# EAGLE design Board_v2 (EAGLE 9.2.2)
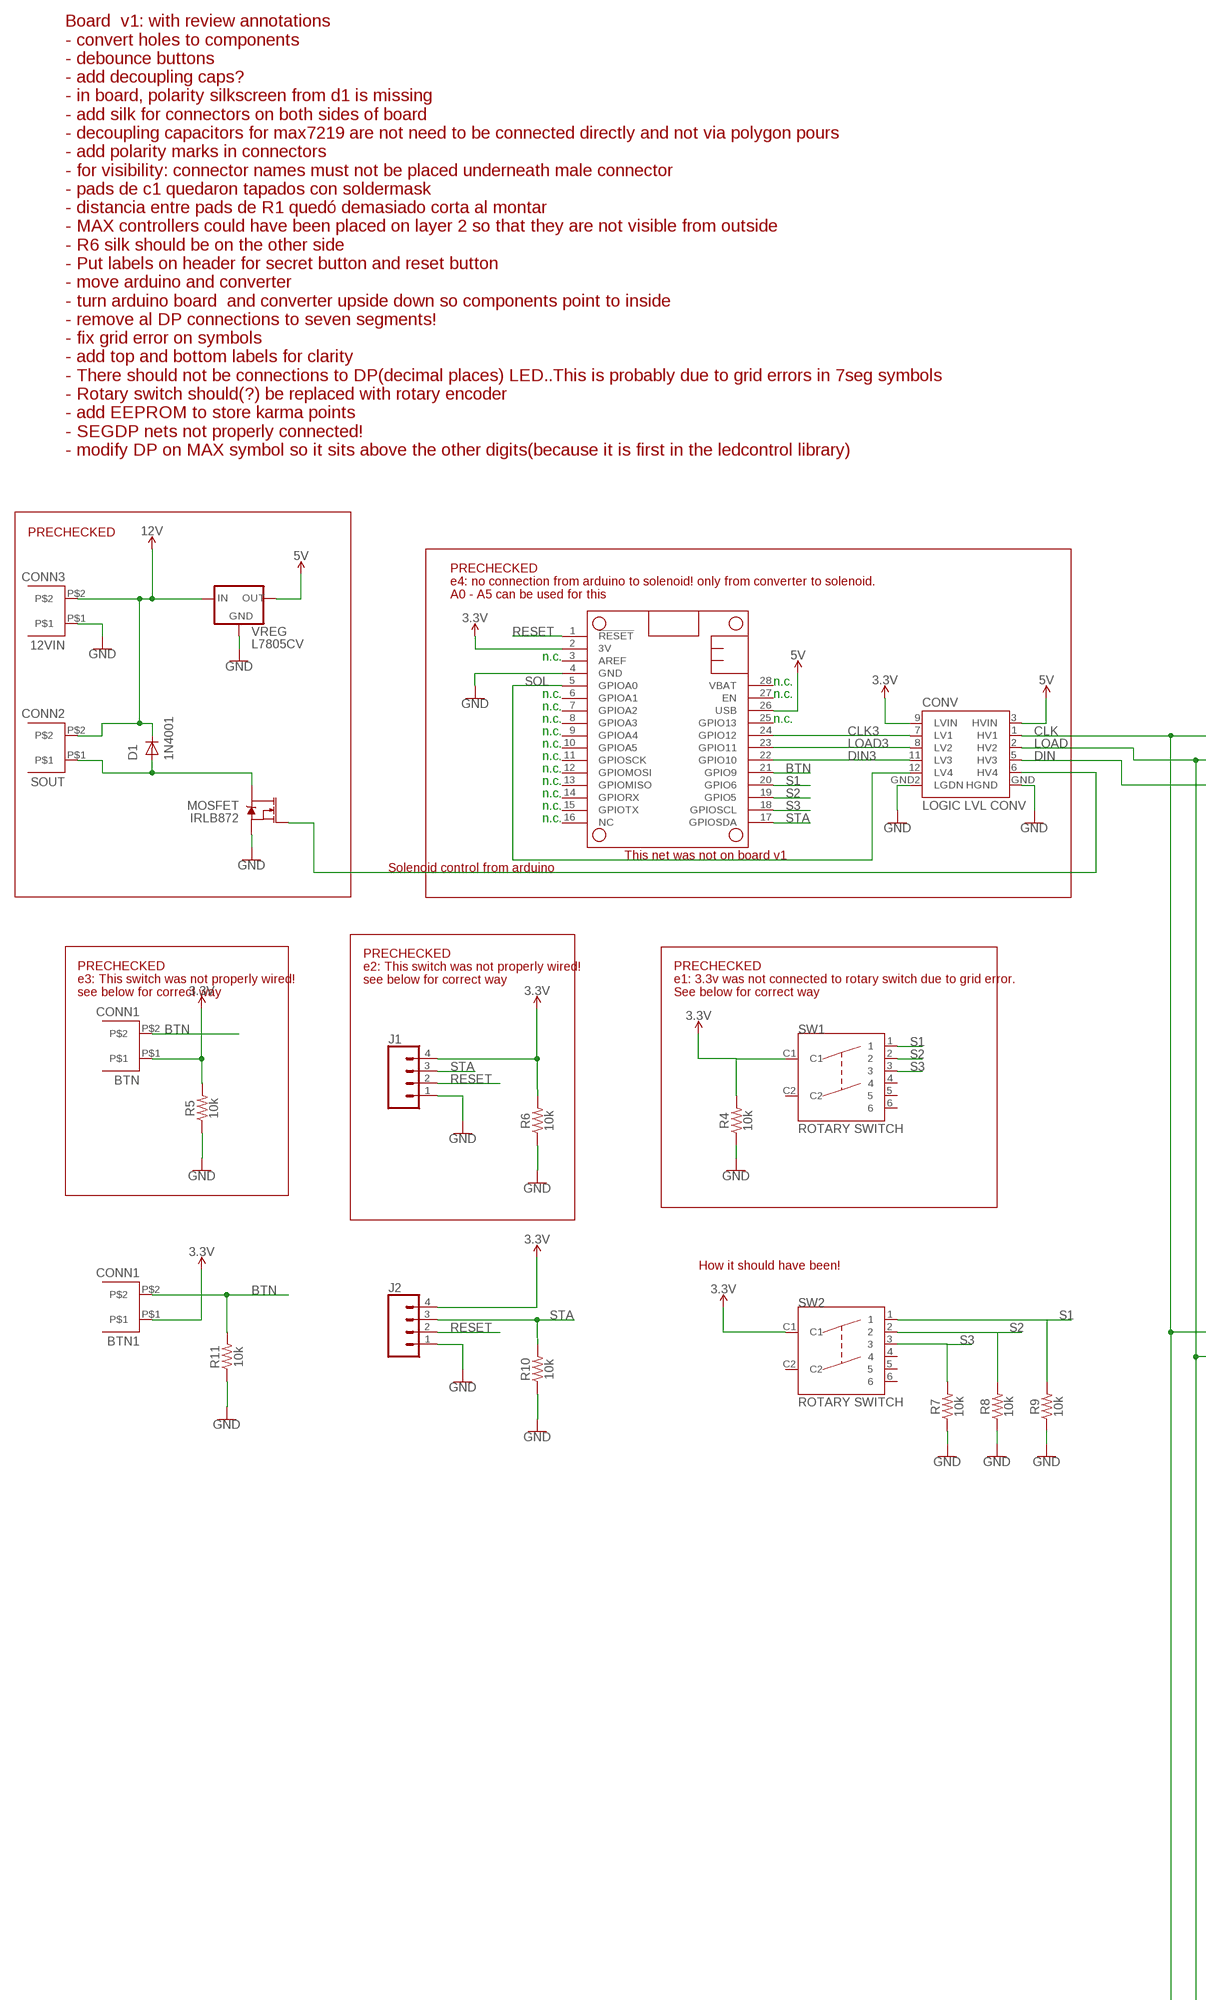
[diagram p0: schematic, sheet 1, part 1 of 3]
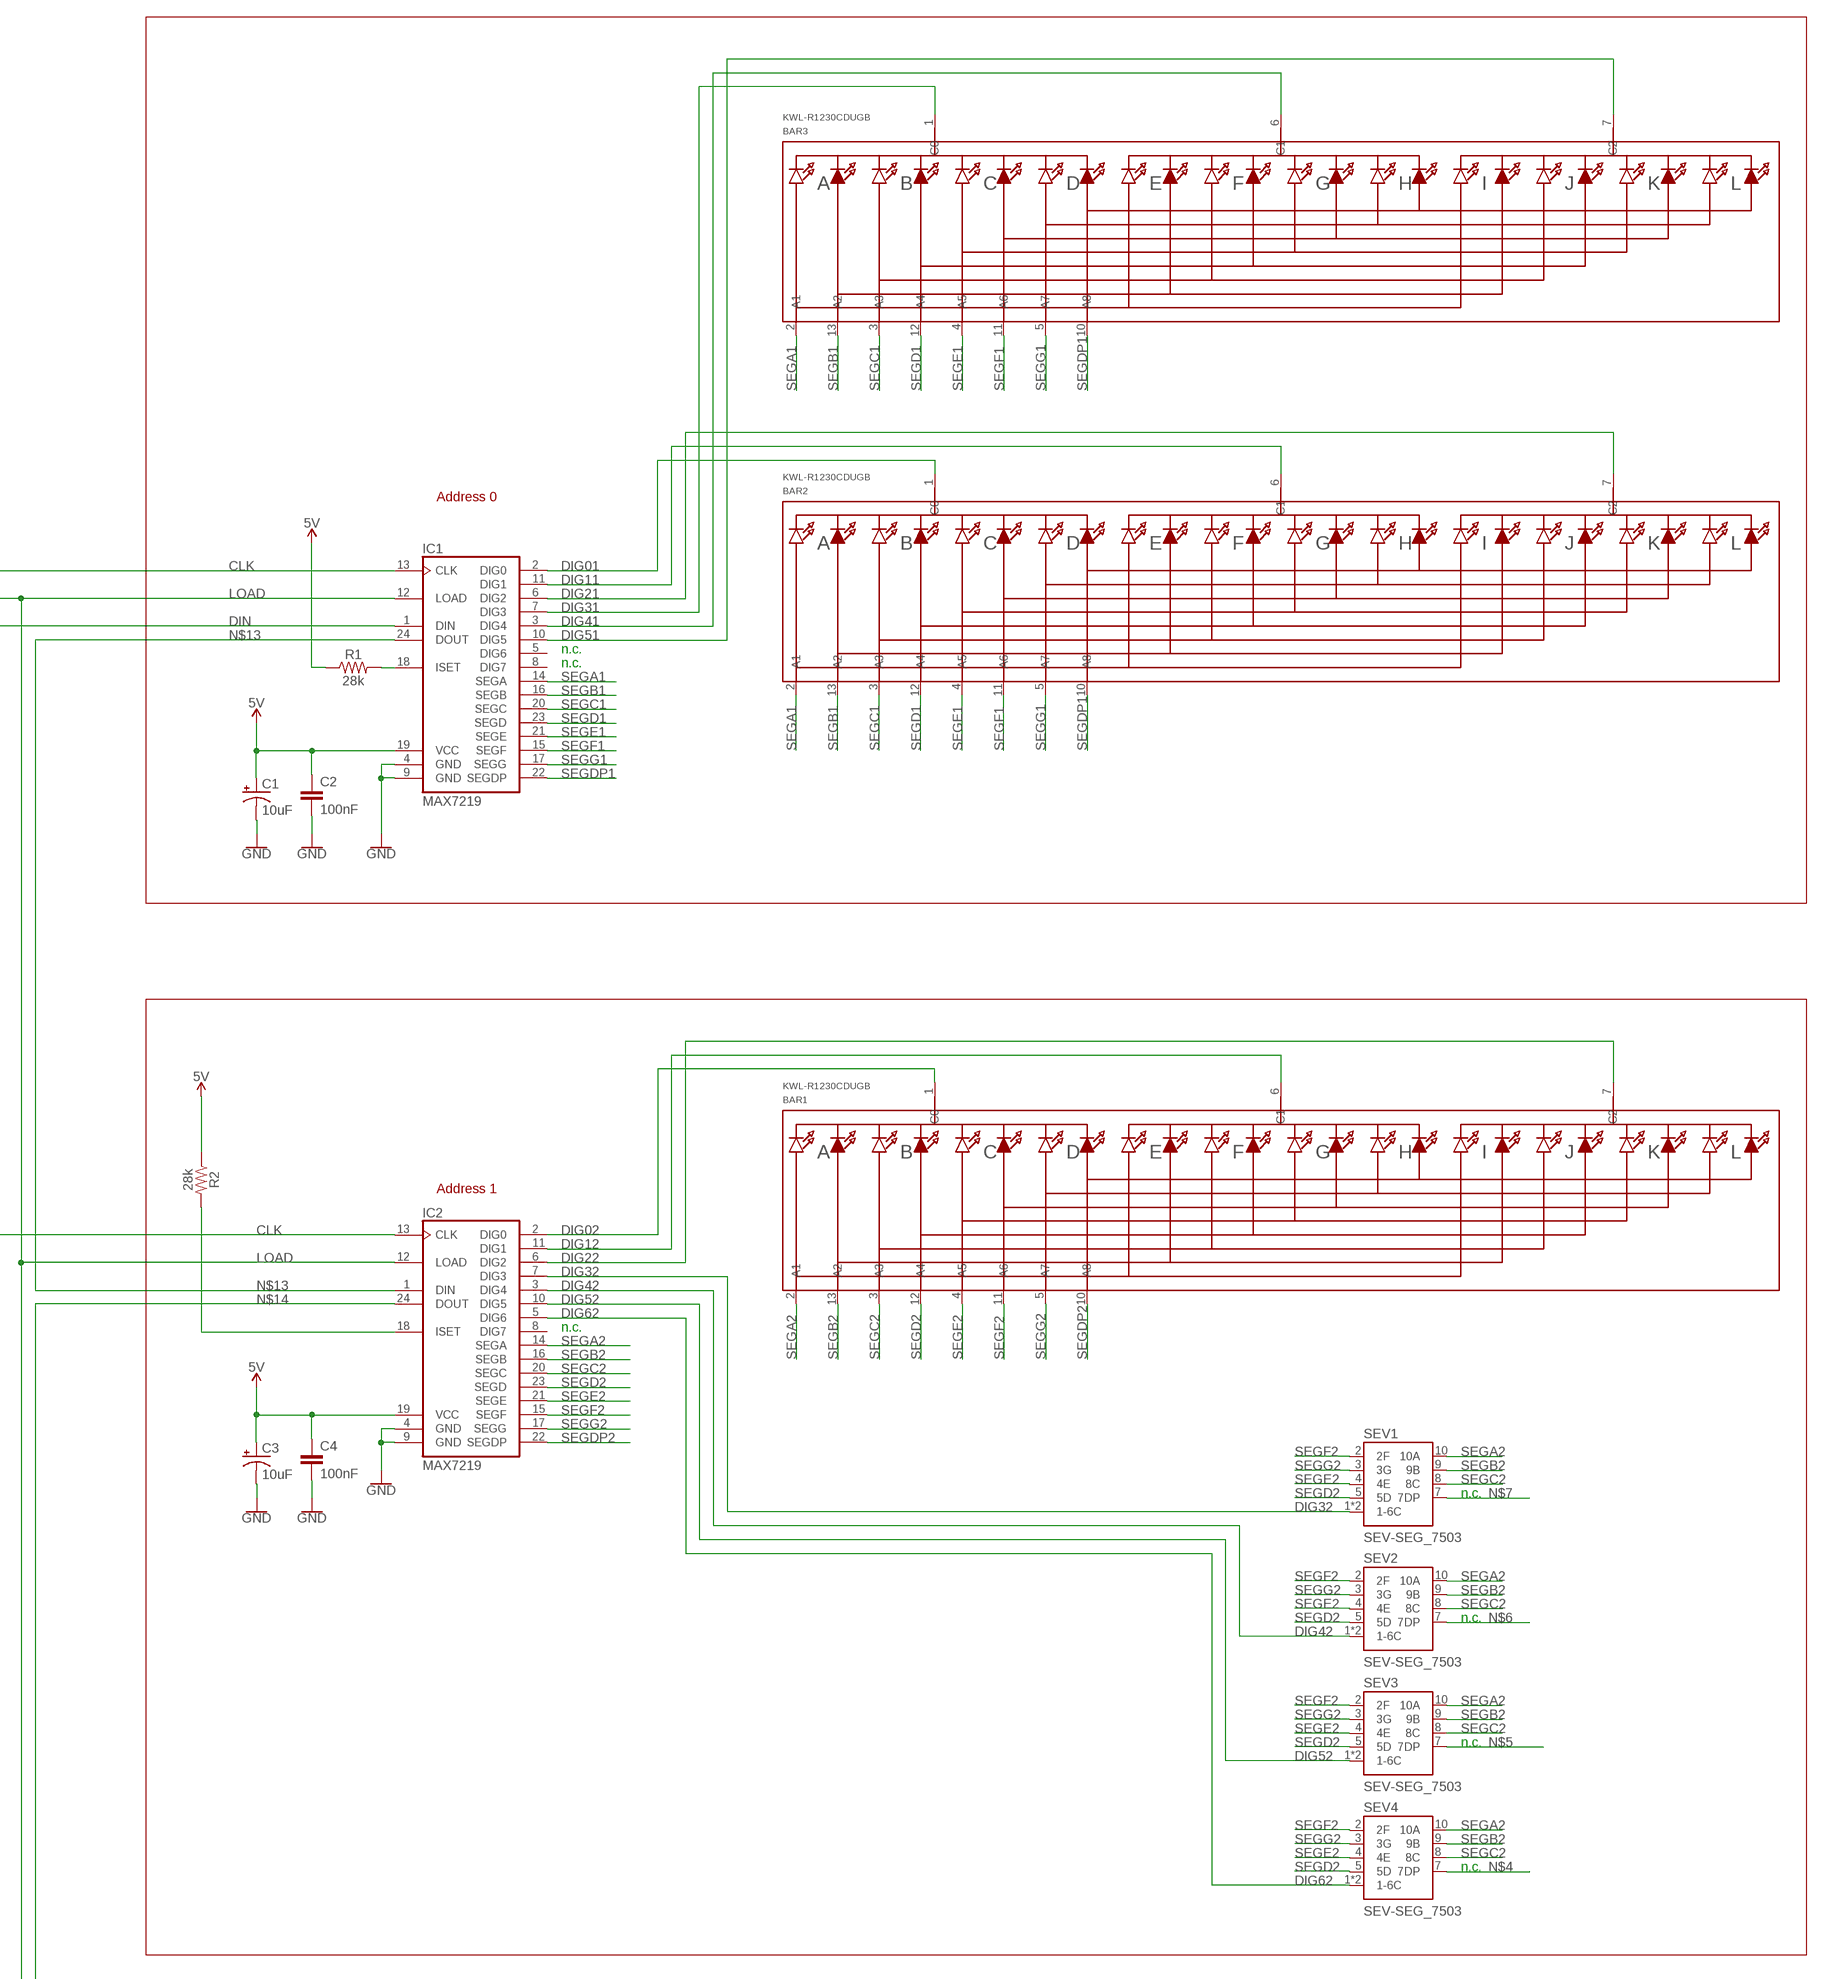
[diagram p1: schematic, sheet 1, part 2 of 3]
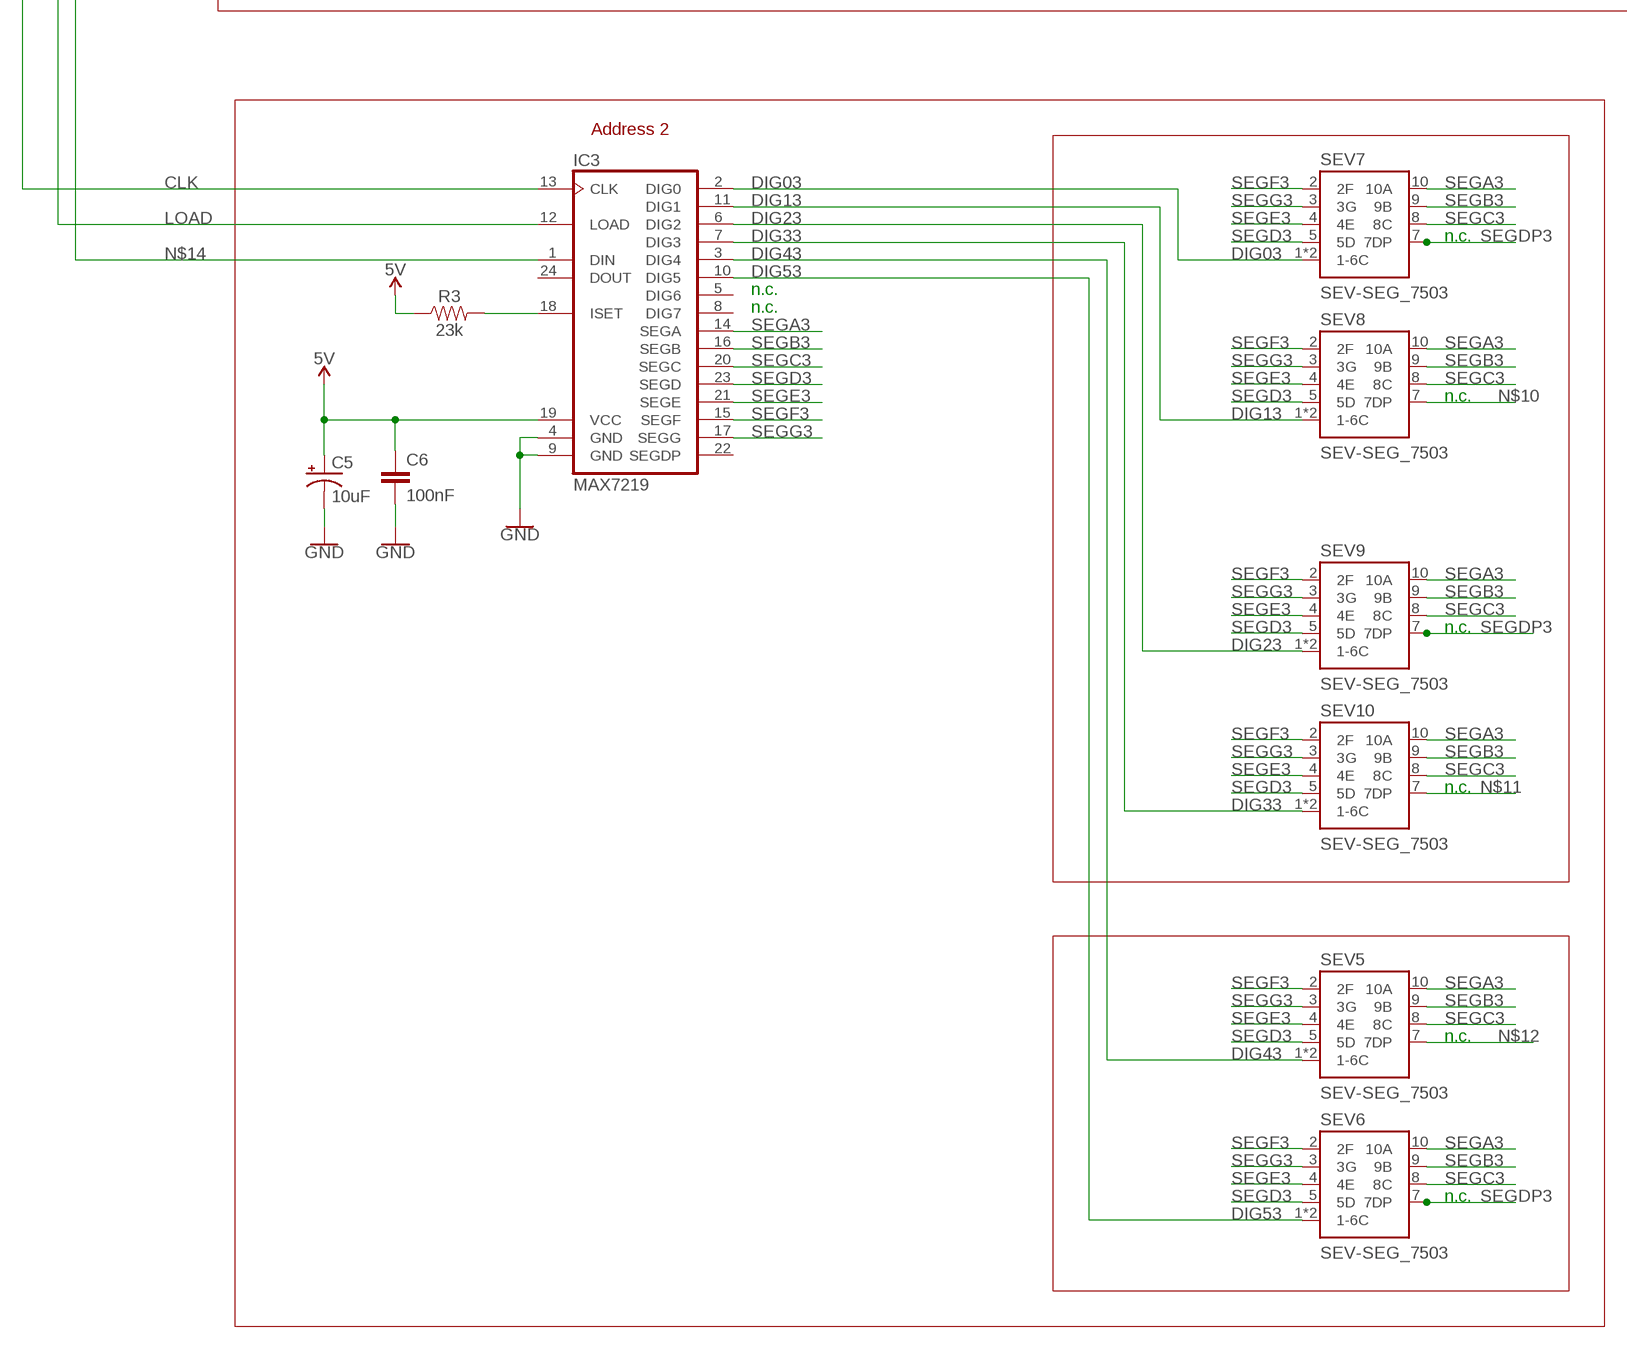
[diagram p2: schematic, sheet 1, part 3 of 3]

## Parts
12VIN  CONN3  MICRO-FIT_3.0_43650  [MICRO-FIT_43560_3MM]
BAR1  KWL-R1230CDUGB  [SEGMENT_BICOL_BL-AR12Z3010]
BAR2  KWL-R1230CDUGB  [SEGMENT_BICOL_BL-AR12Z3010]
BAR3  KWL-R1230CDUGB  [SEGMENT_BICOL_BL-AR12Z3010]
BTN  CONN1  MICRO-FIT_3.0_43650  [MICRO-FIT_43560_3MM]
BTN1  CONN1  MICRO-FIT_3.0_43650  [MICRO-FIT_43560_3MM]
C1  10uF  CAP_POL  [CPOL-RADIAL-2.5MM-5MM-KIT]
C2  100nF  CAP_CERAMIC  [CAP-PTH-5MM]
C3  10uF  CAP_POL  [CPOL-RADIAL-2.5MM-5MM-KIT]
C4  100nF  CAP_CERAMIC  [CAP-PTH-5MM]
C5  10uF  CAP_POL  [CPOL-RADIAL-2.5MM-5MM-KIT]
C6  100nF  CAP_CERAMIC  [CAP-PTH-5MM]
CONV  LOGIC LVL CONV  3-5V_LOGIC_LVL_CONV  [3-5V_LOGIC_LVL_CONV]
D1  1N4001  [CASE59−10-AXIAL]
FEATHERM0  FEATHERWING_NODIM  [FEATHER]
IC1  MAX7219  MAX7219CNG  [DIL24-3]
IC2  MAX7219  MAX7219CNG  [DIL24-3]
IC3  MAX7219  MAX7219CNG  [DIL24-3]
J1  CONN_041X04_NO_SILK  [1X04_NO_SILK]
J2  CONN_041X04_NO_SILK  [1X04_NO_SILK]
MOSFET  IRLB872  [TO-220-ALT]
R1  28k  RESISTOR  [AXIAL-0.3]
R2  28k  RESISTOR  [AXIAL-0.3]
R3  23k  RESISTOR  [AXIAL-0.3]
R4  10k  RESISTOR  [AXIAL-0.3]
R5  10k  RESISTOR  [AXIAL-0.3]
R6  10k  RESISTOR  [AXIAL-0.3]
R7  10k  RESISTOR  [AXIAL-0.3]
R8  10k  RESISTOR  [AXIAL-0.3]
R9  10k  RESISTOR  [AXIAL-0.3]
R10  10k  RESISTOR  [AXIAL-0.3]
R11  10k  RESISTOR  [AXIAL-0.3]
SEV1  SEV-SEG_7503  [HDSP-7503-C]
SEV2  SEV-SEG_7503  [HDSP-7503-C]
SEV3  SEV-SEG_7503  [HDSP-7503-C]
SEV4  SEV-SEG_7503  [HDSP-7503-C]
SEV5  SEV-SEG_7503  [HDSP-7503-C]
SEV6  SEV-SEG_7503  [HDSP-7503-C]
SEV7  SEV-SEG_7503  [HDSP-7503-C]
SEV8  SEV-SEG_7503  [HDSP-7503-C]
SEV9  SEV-SEG_7503  [HDSP-7503-C]
SEV10  SEV-SEG_7503  [HDSP-7503-C]
SOUT  CONN2  MICRO-FIT_3.0_43650  [MICRO-FIT_43560_3MM]
SW1  ROTARY SWITCH  MRB_ROTARY_SWITCH  [MRB24B_SP3T]
SW2  ROTARY SWITCH  MRB_ROTARY_SWITCH  [MRB24B_SP3T]
VREG  L7805CV  [TO-220-ALT]

## Nets
3.3V: BTN1.P$1 BTN.P$1 CONV.9(LVIN) FEATHERM0.2(3V) J1.4 J2.4 R4.P$2 R5.P$2 R6.P$2 SW1.C1 SW2.C1
5V: C1.1(+) C2.1 C3.1(+) C4.1 C5.1(+) C6.1 CONV.3(HVIN) FEATHERM0.26(USB) IC1.19(VCC) IC2.19(VCC) IC3.19(VCC) R1.P$1 R2.P$1 R3.P$1 VREG.OUT
12V: 12VIN.P$2 D1.CAT(C) SOUT.P$2 VREG.IN
BTN: BTN1.P$2 BTN.P$2 FEATHERM0.21(GPIO9) R11.P$2
CLK: CONV.1(HV1) IC1.13(CLK) IC2.13(CLK) IC3.13(CLK)
CLK3: CONV.7(LV1) FEATHERM0.24(GPIO12)
DIG01: BAR2.1(C0) IC1.2(DIG0)
DIG02: BAR1.1(C0) IC2.2(DIG0)
DIG03: IC3.2(DIG0) SEV7.1(1-6C) SEV7.6(1-6C)
DIG11: BAR2.6(C1) IC1.11(DIG1)
DIG12: BAR1.6(C1) IC2.11(DIG1)
DIG13: IC3.11(DIG1) SEV8.1(1-6C) SEV8.6(1-6C)
DIG21: BAR2.7(C2) IC1.6(DIG2)
DIG22: BAR1.7(C2) IC2.6(DIG2)
DIG23: IC3.6(DIG2) SEV9.1(1-6C) SEV9.6(1-6C)
DIG31: BAR3.1(C0) IC1.7(DIG3)
DIG32: IC2.7(DIG3) SEV1.1(1-6C) SEV1.6(1-6C)
DIG33: IC3.7(DIG3) SEV10.1(1-6C) SEV10.6(1-6C)
DIG41: BAR3.6(C1) IC1.3(DIG4)
DIG42: IC2.3(DIG4) SEV2.1(1-6C) SEV2.6(1-6C)
DIG43: IC3.3(DIG4) SEV5.1(1-6C) SEV5.6(1-6C)
DIG51: BAR3.7(C2) IC1.10(DIG5)
DIG52: IC2.10(DIG5) SEV3.1(1-6C) SEV3.6(1-6C)
DIG53: IC3.10(DIG5) SEV6.1(1-6C) SEV6.6(1-6C)
DIG62: IC2.5(DIG6) SEV4.1(1-6C) SEV4.6(1-6C)
DIN: CONV.5(HV3) IC1.1(DIN)
DIN3: CONV.11(LV3) FEATHERM0.22(GPIO10)
GND: 12VIN.P$1 C1.2(-) C2.2 C3.2(-) C4.2 C5.2(-) C6.2 CONV.GND2(LGDN) CONV.GND(HGND) FEATHERM0.4(GND) IC1.4(GND) IC1.9(GND) IC2.4(GND) IC2.9(GND) IC3.4(GND) IC3.9(GND) J1.1 J2.1 MOSFET.OUT(S) R4.P$1 R5.P$1 R6.P$1 R7.P$1 R8.P$1 R9.P$1 R10.P$1 R11.P$1 VREG.GND
LOAD: CONV.2(HV2) IC1.12(LOAD) IC2.12(LOAD) IC3.12(LOAD)
LOAD3: CONV.8(LV2) FEATHERM0.23(GPIO11)
N$1: IC1.18(ISET) R1.P$2
N$2: D1.ANOD(A) MOSFET.GND(D) SOUT.P$1
N$3: CONV.6(HV4) MOSFET.IN(G)
N$4: SEV4.7(7DP)
N$5: SEV3.7(7DP)
N$6: SEV2.7(7DP)
N$7: SEV1.7(7DP)
N$8: IC3.18(ISET) R3.P$2
N$9: IC2.18(ISET) R2.P$2
N$10: SEV8.7(7DP)
N$11: SEV10.7(7DP)
N$12: SEV5.7(7DP)
N$13: IC1.24(DOUT) IC2.1(DIN)
N$14: IC2.24(DOUT) IC3.1(DIN)
RESET: FEATHERM0.1(!RESET) J1.2 J2.2
S1: FEATHERM0.20(GPIO6) R9.P$2 SW1.1 SW2.1
S2: FEATHERM0.19(GPIO5) R8.P$2 SW1.2 SW2.2
S3: FEATHERM0.18(GPIOSCL) R7.P$2 SW1.3 SW2.3
SEGA1: BAR2.2(A1) BAR3.2(A1) IC1.14(SEGA)
SEGA2: BAR1.2(A1) IC2.14(SEGA) SEV1.10(10A) SEV2.10(10A) SEV3.10(10A) SEV4.10(10A)
SEGA3: IC3.14(SEGA) SEV5.10(10A) SEV6.10(10A) SEV7.10(10A) SEV8.10(10A) SEV9.10(10A) SEV10.10(10A)
SEGB1: BAR2.13(A2) BAR3.13(A2) IC1.16(SEGB)
SEGB2: BAR1.13(A2) IC2.16(SEGB) SEV1.9(9B) SEV2.9(9B) SEV3.9(9B) SEV4.9(9B)
SEGB3: IC3.16(SEGB) SEV5.9(9B) SEV6.9(9B) SEV7.9(9B) SEV8.9(9B) SEV9.9(9B) SEV10.9(9B)
SEGC1: BAR2.3(A3) BAR3.3(A3) IC1.20(SEGC)
SEGC2: BAR1.3(A3) IC2.20(SEGC) SEV1.8(8C) SEV2.8(8C) SEV3.8(8C) SEV4.8(8C)
SEGC3: IC3.20(SEGC) SEV5.8(8C) SEV6.8(8C) SEV7.8(8C) SEV8.8(8C) SEV9.8(8C) SEV10.8(8C)
SEGD1: BAR2.12(A4) BAR3.12(A4) IC1.23(SEGD)
SEGD2: BAR1.12(A4) IC2.23(SEGD) SEV1.5(5D) SEV2.5(5D) SEV3.5(5D) SEV4.5(5D)
SEGD3: IC3.23(SEGD) SEV5.5(5D) SEV6.5(5D) SEV7.5(5D) SEV8.5(5D) SEV9.5(5D) SEV10.5(5D)
SEGDP1: BAR2.10(A8) BAR3.10(A8) IC1.22(SEGDP)
SEGDP2: BAR1.10(A8) IC2.22(SEGDP)
SEGDP3: SEV6.7(7DP) SEV7.7(7DP) SEV9.7(7DP)
SEGE1: BAR2.4(A5) BAR3.4(A5) IC1.21(SEGE)
SEGE2: BAR1.4(A5) IC2.21(SEGE) SEV1.4(4E) SEV2.4(4E) SEV3.4(4E) SEV4.4(4E)
SEGE3: IC3.21(SEGE) SEV5.4(4E) SEV6.4(4E) SEV7.4(4E) SEV8.4(4E) SEV9.4(4E) SEV10.4(4E)
SEGF1: BAR2.11(A6) BAR3.11(A6) IC1.15(SEGF)
SEGF2: BAR1.11(A6) IC2.15(SEGF) SEV1.2(2F) SEV2.2(2F) SEV3.2(2F) SEV4.2(2F)
SEGF3: IC3.15(SEGF) SEV5.2(2F) SEV6.2(2F) SEV7.2(2F) SEV8.2(2F) SEV9.2(2F) SEV10.2(2F)
SEGG1: BAR2.5(A7) BAR3.5(A7) IC1.17(SEGG)
SEGG2: BAR1.5(A7) IC2.17(SEGG) SEV1.3(3G) SEV2.3(3G) SEV3.3(3G) SEV4.3(3G)
SEGG3: IC3.17(SEGG) SEV5.3(3G) SEV6.3(3G) SEV7.3(3G) SEV8.3(3G) SEV9.3(3G) SEV10.3(3G)
SOL: CONV.12(LV4) FEATHERM0.5(GPIOA0)
STA: FEATHERM0.17(GPIOSDA) J1.3 J2.3 R10.P$2
Unconnected: FEATHERM0.3(AREF) FEATHERM0.6(GPIOA1) FEATHERM0.7(GPIOA2) FEATHERM0.8(GPIOA3) FEATHERM0.9(GPIOA4) FEATHERM0.10(GPIOA5) FEATHERM0.11(GPIOSCK) FEATHERM0.12(GPIOMOSI) FEATHERM0.13(GPIOMISO) FEATHERM0.14(GPIORX) FEATHERM0.15(GPIOTX) FEATHERM0.16(NC) FEATHERM0.25(GPIO13) FEATHERM0.27(EN) FEATHERM0.28(VBAT) IC1.5(DIG6) IC1.8(DIG7) IC2.8(DIG7) IC3.5(DIG6) IC3.8(DIG7) IC3.22(SEGDP) IC3.24(DOUT) SW1.4 SW1.5 SW1.6 SW1.C2 SW2.4 SW2.5 SW2.6 SW2.C2

## Notes on the sheet
- Board  v1: with review annotations
  - convert holes to components
  - debounce buttons
  - add decoupling caps?
  - in board, polarity silkscreen from d1 is missing
  - add silk for connectors on both sides of board
  - decoupling capacitors for max7219 are not need to be connected directly and not via polygon pours
  - add polarity marks in connectors
  - for visibility: connector names must not be placed underneath male connector 
  - pads de c1 quedaron tapados con soldermask
  - distancia entre pads de R1 quedó demasiado corta al montar 
  - MAX controllers could have been placed on layer 2 so that they are not visible from outside
  - R6 silk should be on the other side
  - Put labels on header for secret button and reset button
  - move arduino and converter
  - turn arduino board  and converter upside down so components point to inside
  - remove al DP connections to seven segments!
  - fix grid error on symbols
  - add top and bottom labels for clarity
  - There should not be connections to DP(decimal places) LED..This is probably due to grid errors in 7seg symbols
  - Rotary switch should(?) be replaced with rotary encoder
  - add EEPROM to store karma points 
  - SEGDP nets not properly connected!
  - modify DP on MAX symbol so it sits above the other digits(because it is first in the ledcontrol library)
- PRECHECKED
- PRECHECKED
  e4: no connection from arduino to solenoid! only from converter to solenoid.
  A0 - A5 can be used for this
- n.c.
- Address 0
- n.c.
- n.c. | n.c.
- n.c.
- n.c. | n.c.
- n.c.
- n.c.
- n.c.
- n.c.
- n.c.
- n.c.
- n.c. | n.c.
- n.c. | n.c.
- This net was not on board v1
- Solenoid control from arduino
- PRECHECKED
  e2: This switch was not properly wired! 
  see below for correct way
- PRECHECKED
  e3: This switch was not properly wired! 
  see below for correct way
- PRECHECKED
  e1: 3.3v was not connected to rotary switch due to grid error.
  See below for correct way
- How it should have been!
- Address 1
- n.c.
- n.c.
- n.c.
- n.c.
- n.c.
- Address 2
- n.c.
- n.c.
- n.c.
- n.c.
- n.c.
- n.c.
- n.c.
- n.c.

## Library data of the parts
12VIN BTN BTN1 SOUT = AES_lib:MICRO-FIT_3.0_43650
BAR1-BAR3 = AES_lib:KWL-R1230CDUGB
C1 C3 C5 = AES_lib:CAP_POL
C2 C4 C6 = AES_lib:CAP_CERAMIC
CONV = AES_lib:3-5V_LOGIC_LVL_CONV
D1 = AES_lib:1N4001
FEATHERM0 = AES_lib:FEATHERWING
IC1-IC3 = AES_lib:MAX7219CNG: LED DISPLAY DRIVER; MF: MAXIM; MPN: MAX7219CNG; OC_FARNELL: 1523914; OC_NEWARK: 34C4018
J1 J2 = SparkFun-Connectors:CONN_04: Multi connection point. Often used as Generic Header-pin footprint for 0.1 inch spaced/style header connections On any of the 0.1 inch spaced packages, you can populate with these: Break Away Headers - Straight <https://www.sparkfun.com/products/116> (PRT-00116) Break Away Male Headers - Right Angle <https://www.sparkfun.com/products/553> (PRT-00553) Female Headers <https://www.sparkfun.com/products/115> (PRT-00115) Break Away Headers - Machine Pin <https://www.sparkfun.com/products/117> (PRT-00117) Break Away Female Headers - Swiss Machine Pin <https://www.sparkfun.com/products/743> (PRT-00743) For SCREWTERMINALS and SPRING TERMINALS visit here: Screw Terimnals on SparkFun.com <https://www.sparkfun.com/search/results?term=Screw+Terminals> (5mm/3.5mm/2.54mm spacing) This device is also useful as a general connection point to wire up your design to another part of your project. Our various solder wires solder well into these plated through hole pads. Hook-Up Wire - Assortment (Stranded, 22 AWG) <https://www.sparkfun.com/products/11375> (PRT-11375) Hook-Up Wire - Assortment (Solid Core, 22 AWG) <https://www.sparkfun.com/products/11367> (PRT-11367) View the entire wire category on our website here <https://www.sparkfun.com/categories/141> Special notes: Molex polarized connector foot print use with SKU : PRT-08231 with associated crimp pins and housings. 1MM SMD Version SKU: PRT-10208; PROD_ID: CONN-09696
MOSFET = AES_lib:IRLB872
R1-R11 = AES_lib:RESISTOR
SEV1-SEV10 = AES_lib:SEV-SEG_7503
SW1 SW2 = AES_lib:MRB_ROTARY_SWITCH
VREG = AES_lib:L7805CV

## Board
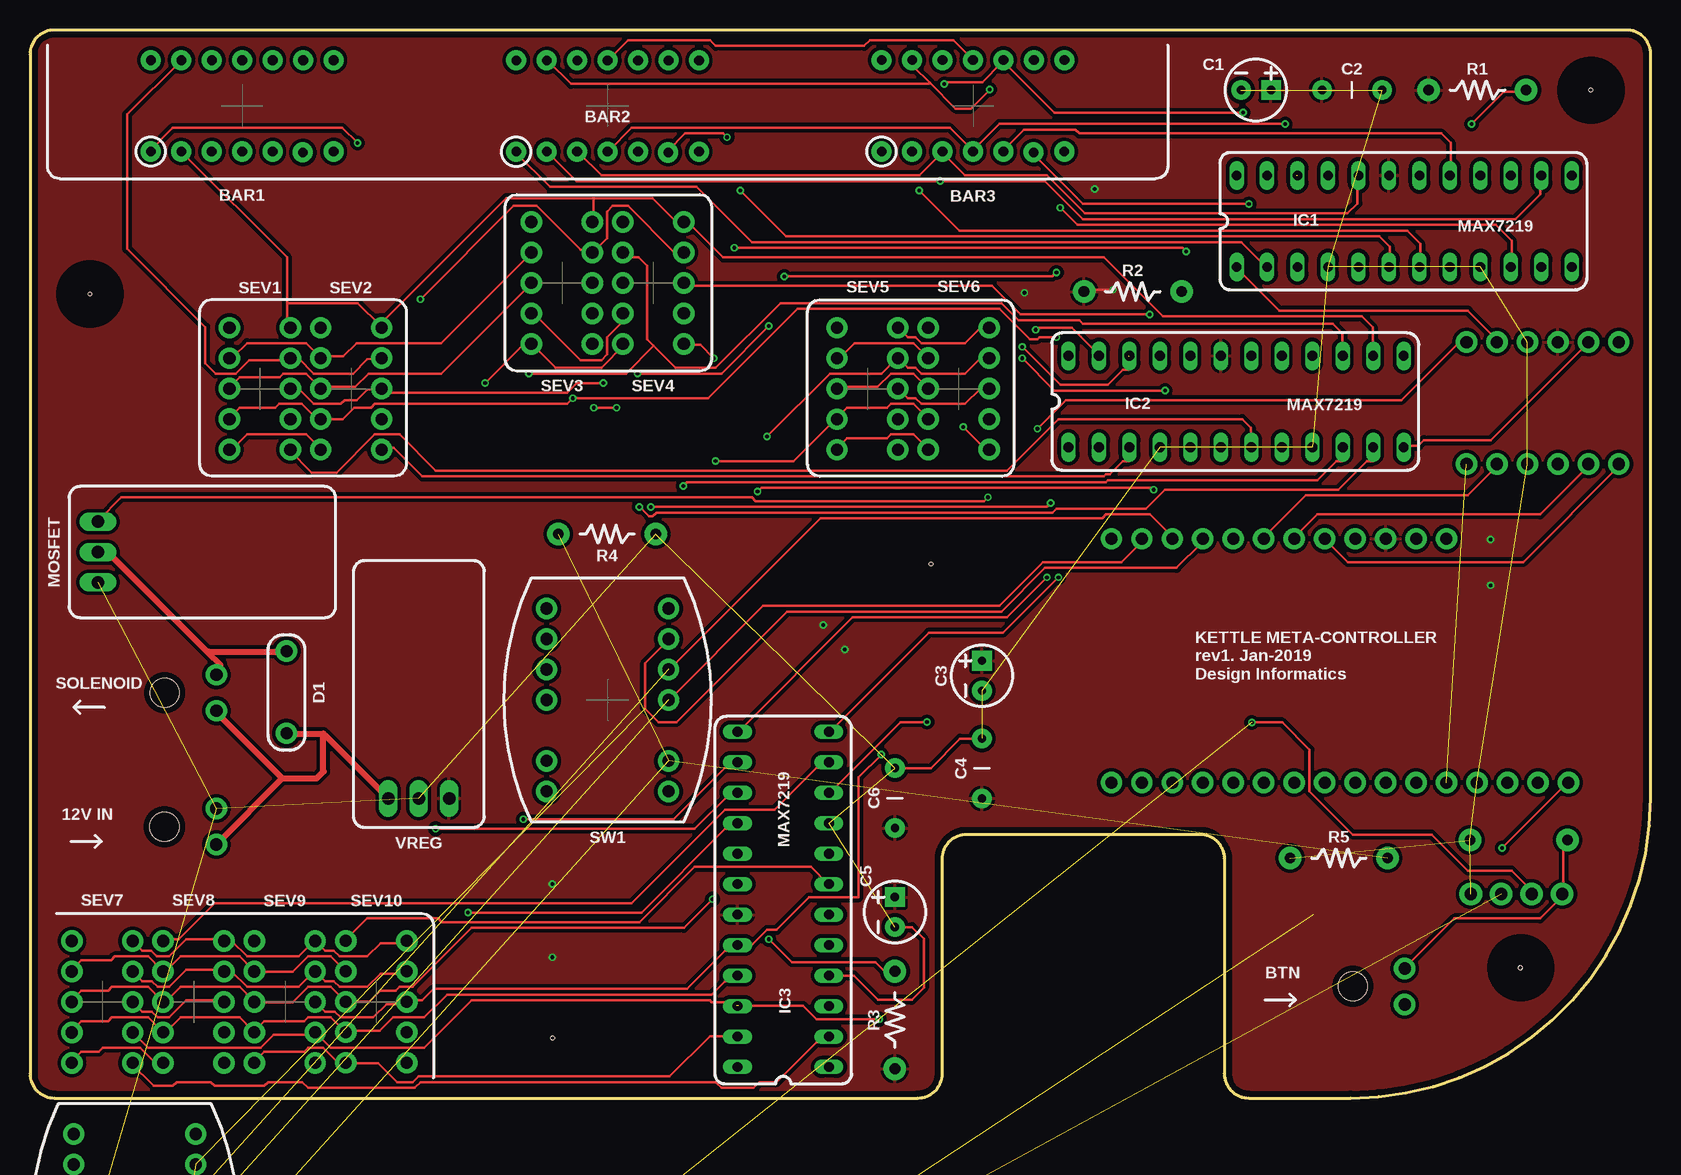
[diagram p3: board, top side]
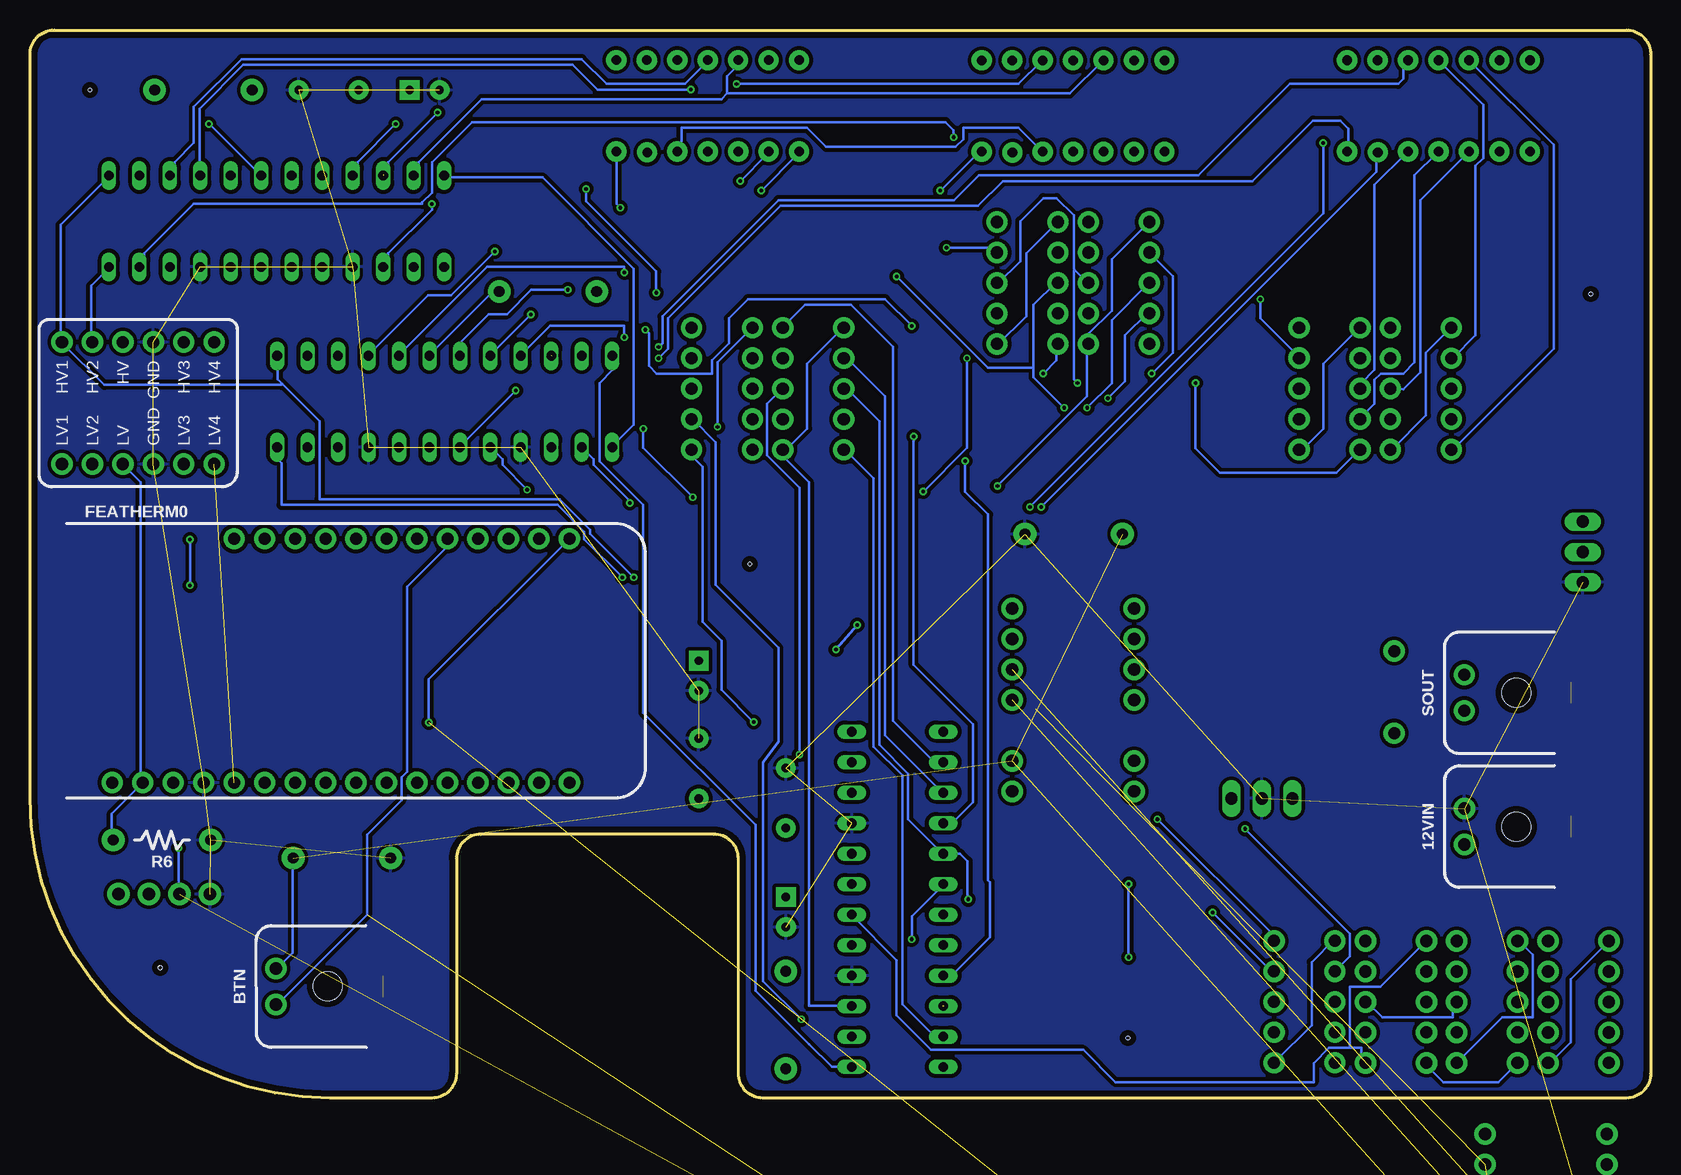
[diagram p4: board, bottom side, seen from below]

Size 135.1 x 89 mm. Coordinates in mm from the lower left corner, seen from the top.
Outline: 0,86.97 0,2.03 arc90 2.03,0 74.02,0 arc90 76.05,2.03 76.05,19.95 arc-90 78.08,21.98 97.52,21.98 arc-90 99.55,19.95 99.55,2.03 arc90 101.58,0 110.1,0 arc90 135.1,25 135.1,86.97 arc90 133.07,89 2.03,89 arc90 0,86.97
Copper layers (1*16): Top 0.035mm / dielectric 1.6mm / Bottom 0.035mm
Design rules "Elecrow_2-layer_PCB_eagle_rule": minimum track width 6mil, minimum drill 12mil, track to track 6mil, track to pad 6mil, pad to pad 6mil, via to via 8mil, smd to smd 0mil, copper to edge 20mil, drill to drill 10mil, minimum pad ring 6mil, minimum via ring 6mil, stop-mask expansion 0mil, vias tented up to drill 100mil, thermal gap 10mil
Holes 0.3 mm at 43.57,5 124.24,10.86 75.1,44.5 5,67 130.1,84
tRestrict: area 122.3,8.8 to 126.3,12.8; area 128.1,82 to 132.1,86; area 41.6,3 to 45.6,7; area 3,65 to 7,69; area 73.1,42.6 to 77.1,46.6

### Footprints (pad centres in the part's own frame; a part is rotated, then mirrored left to right if it is on the bottom)
MICRO-FIT_43560_3MM = drill 1.016 pad 1.778: P$1 1.5,0; P$2 -1.5,0 | hole 2.41: 0,-4.32
SEGMENT_BICOL_BL-AR12Z3010 = drill 0.8 pad 1.676: 1 -3.803,7.621; 2 -3.803,5.081; 3 -3.803,2.541; 4 -3.803,0.001; 5 -3.803,-2.539; 6 -3.879,-5.054; 7 -3.803,-7.619; 8 3.803,-7.621; 9 3.803,-5.081; 10 3.803,-2.541; 11 3.803,-0.001; 12 3.803,2.539; 13 3.803,5.079; 14 3.803,7.619
CPOL-RADIAL-2.5MM-5MM-KIT = drill 0.7 pad 1.651 square: 1 1.25,0 | drill 0.7 pad 1.651: 2 -1.25,0
CAP-PTH-5MM = drill 0.7 pad 1.651: 1 -2.5,0; 2 2.5,0
3-5V_LOGIC_LVL_CONV = drill 1.016 pad 1.778: 1 -6.35,5.08; 2 -3.81,5.08; 3 -1.27,5.08; 5 3.81,5.08; 6 6.35,5.08; 7 -6.35,-5.08; 8 -3.81,-5.08; 9 -1.27,-5.08; 11 3.81,-5.08; 12 6.35,-5.08; GND 1.27,5.08; GND2 1.27,-5.08
CASE59−10-AXIAL = drill 1.016 pad 1.778: ANOD -3.445,0; CAT 3.397,0
FEATHER = drill 1 pad 1.778: 1 6.35,1.27; 2 8.89,1.27; 3 11.43,1.27; 4 13.97,1.27; 5 16.51,1.27; 6 19.05,1.27; 7 21.59,1.27; 8 24.13,1.27; 9 26.67,1.27; 10 29.21,1.27; 11 31.75,1.27; 12 34.29,1.27; 13 36.83,1.27; 14 39.37,1.27; 15 41.91,1.27; 16 44.45,1.27; 17 44.45,21.59; 18 41.91,21.59; 19 39.37,21.59; 20 36.83,21.59; 21 34.29,21.59; 22 31.75,21.59; 23 29.21,21.59; 24 26.67,21.59; 25 24.13,21.59; 26 21.59,21.59; 27 19.05,21.59; 28 16.51,21.59
DIL24-3 = drill 0.813 long: 1 -13.97,-3.81; 2 -11.43,-3.81; 3 -8.89,-3.81; 4 -6.35,-3.81; 5 -3.81,-3.81; 6 -1.27,-3.81; 7 1.27,-3.81; 8 3.81,-3.81; 9 6.35,-3.81; 10 8.89,-3.81; 11 11.43,-3.81; 12 13.97,-3.81; 13 13.97,3.81; 14 11.43,3.81; 15 8.89,3.81; 16 6.35,3.81; 17 3.81,3.81; 18 1.27,3.81; 19 -1.27,3.81; 20 -3.81,3.81; 21 -6.35,3.81; 22 -8.89,3.81; 23 -11.43,3.81; 24 -13.97,3.81
1X04_NO_SILK = drill 1.016 pad 1.88: 1 0,0; 2 2.54,0; 3 5.08,0; 4 7.62,0
TO-220-ALT = drill 1.016 long: GND 0,0.19; IN -2.54,0.19; OUT 2.54,0.19
AXIAL-0.3 = drill 0.9 pad 1.88: P$1 -4.064,0; P$2 4.064,0
HDSP-7503-C = drill 1.016 pad 1.778: 1 -2.54,5.08; 2 -2.54,2.54; 3 -2.54,0; 4 -2.54,-2.54; 5 -2.54,-5.08; 6 2.54,-5.08; 7 2.54,-2.54; 8 2.54,0; 9 2.54,2.54; 10 2.54,5.08
MRB24B_SP3T = drill 1.016 pad 1.778: 1 5.08,5.08; 2 5.08,2.54; 3 5.08,0; 4 -5.08,5.08; 5 -5.08,2.54; 6 -5.08,0; B1 5.08,-7.62; B2 -5.08,-7.62; B3 5.08,7.62; B4 -5.08,7.62; C1 5.08,-5.08; C2 -5.08,-5.08

### Placement (x,y rotation side)
12VIN  15.53,22.62 90 bottom
BAR1  17.69,82.68 90 top
BAR2  48.15,82.67 90 top
BAR3  78.61,82.68 90 top
BTN  114.59,9.3 90 bottom
BTN1  5.18,-52.78 0 top  (outside the outline)
C1  102.2,84 0 top
C2  110.2,84 0 top
C3  79.36,35.19 90 top
C4  79.36,27.46 90 top
C5  72.09,15.5 90 top
C6  72.1,25 90 top
CONV  126.09,57.91 0 bottom
D1  21.38,33.79 270 top
FEATHERM0  134.59,25.01 0 bottom
IC1  114.55,73.07 0 top
IC2  100.54,58.04 0 top
IC3  62.78,16.55 90 top
J1  120.1,17 0 top
J2  1.62,-47.7 0 top  (outside the outline)
MOSFET  5.47,45.5 270 top
R1  120.65,84 0 top
R2  91.93,67.2 0 top
R3  72.09,6.5 90 top
R4  48.1,47 180 top
R5  109.1,20 0 top
R6  124.1,21.5 180 bottom
R7  4.92,-25.86 0 top  (outside the outline)
R8  4.92,-31.45 0 top  (outside the outline)
R9  4.92,-37.03 0 top  (outside the outline)
R10  4.92,-42.62 0 top  (outside the outline)
R11  4.92,-64.72 0 top  (outside the outline)
SEV1  19.16,59.11 0 top
SEV2  26.77,59.11 0 top
SEV3  44.34,67.93 0 top
SEV4  51.96,67.92 0 top
SEV5  69.81,59.11 0 top
SEV6  77.42,59.11 0 top
SEV7  6.03,8 0 top
SEV8  13.63,8.01 0 top
SEV9  21.24,8.01 0 top
SEV10  28.86,8.01 0 top
SOUT  15.54,33.77 90 bottom
SW1  48.15,33.17 0 top
SW2  8.73,-10.62 0 top
VREG  32.41,24.77 0 top

### Tracks (layer width: path | path; a pad name or v marks a point on that pad's centre or on a via)
3.3V  (5 unrouted)
  Top 0.229: R6.P$2 128.11,21.48 127.79,21.48 127.79,17.04 J1.4 127.79,16.88 125.89,14.97 118.75,14.97 114.62,10.84 BTN.P$1
  Bottom 0.229: BTN.P$1 114.46,10.84 113.19,12.12 113.19,19.89 R5.P$2 | R6.P$2 128.27,21.64 128.27,23.7 125.73,26.24 FEATHERM0.2 125.89,26.24 125.89,51.33 127.32,52.76 CONV.9
5V  (via drill 0.3)
  Top 0.229: v90.27,67.36 88.02,67.36 R2.P$1
  Bottom 0.229: v43.53,17.83 v43.53,11.73 | IC2.19 99.27,62.93 96.87,65.33 95.35,65.33 93.31,67.36 v90.27,67.36 | v121.76,46.53 v121.76,42.72 | v66.14,39.42 v67.91,37.39 | v82.9,67.11 82.9,68.88 88.74,74.73 v88.74,75.74
  pour Top (isolate 0.305): 98.91,89 0,89 0,0 76.05,0 76.05,21.98 99.55,21.98 99.55,0 110.1,0 arc90 135.1,25 135.1,89 114.4,88.95
12V
  Top 0.229: 29.85,24.97 VREG.IN | 21.43,30.37 D1.CAT | 15.56,21.16 12VIN.P$2 | 15.56,32.12 SOUT.P$2
  Top 0.508: 24.45,30.37 24.69,30.13 | 24.69,30.13 29.85,24.97 | 21.43,30.37 24.45,30.37 | 21.03,26.64 15.56,21.16 | 24.45,30.05 24.61,30.05 24.69,30.13 | 21.03,26.64 15.56,32.12 | 21.03,26.64 23.89,26.64 24.48,27.23 24.45,27.26 24.45,30.37
BTN  (2 unrouted)
  Bottom 0.229: BTN.P$2 114.46,7.83 107,15.29 107,21.96 104.14,24.82 104.14,26.72 103.66,27.2 103.66,42.59 100.33,45.93 100.33,46.56 FEATHERM0.21
CLK  (via drill 0.3)
  Top 0.229: v84.77,43.39 81.44,40.05 68.58,40.05 59.06,30.53 IC3.13
  Bottom 0.229: IC1.13 128.59,76.73 132.56,72.76 132.56,63.07 CONV.1 132.4,62.91 128.91,59.42 114.14,59.42 114.06,59.5 | v84.77,43.39 88.42,47.04 88.42,47.36 90.96,49.9 110.97,49.9 110.97,56.41 114.06,59.5 | 114.06,59.5 114.46,59.9 114.46,61.8 IC2.13
CLK3
  Top 0.229: FEATHERM0.24 107.95,46.56 109.86,44.66 124.46,44.66 132.56,52.76 CONV.7
DIG01
  Top 0.229: IC1.2 103.03,69.27 100.97,71.33 60.17,71.33 55.56,75.93 43.34,75.93 40.48,78.79 BAR2.1
DIG02  (via drill 0.3)
  Top 0.229: v85.09,49.58 84.77,49.26 v51.75,49.26 | v27.31,79.58 26.04,80.85 11.91,80.85 10,78.95 BAR1.1
  Bottom 0.229: v85.09,49.58 85.09,49.74 88.11,52.76 88.11,53.23 89.06,54.18 IC2.2 | v51.75,49.26 27.31,73.71 v27.31,79.58
DIG03
  Top 0.229: IC3.2 66.52,4.97 66.2,4.65 65.56,4.65 62.23,1.32 60.8,1.32 60.33,0.84 57.63,0.84 57.15,1.32 32.54,1.32 32.07,0.84 23.18,0.84 22.7,1.32 19.84,1.32 19.53,1 15.4,1 15.08,1.32 12.22,1.32 11.91,1 10.32,1 8.41,2.91 SEV7.6
  Bottom 0.229: SEV7.1 3.49,13.07 6.67,9.89 6.67,4.65 8.41,2.91 SEV7.6
DIG11  (via drill 0.3)
  Top 0.229: v58.1,80.06 57.79,80.38 54.61,80.38 53.18,78.95 BAR2.6
  Bottom 0.229: v58.1,80.06 58.1,80.66 58.77,81.33 98.27,81.33 101.6,78 101.6,75.46 102.39,74.66 102.39,74.5 121.44,74.5 125.57,70.38 125.57,69.58 125.89,69.27 IC1.11
DIG12  (via drill 0.3)
  Top 0.229: v50.8,49.26 51.59,48.47 51.91,48.47 52.23,48.79 85.25,48.79 85.57,49.1 93.03,49.1 94.62,50.69 109.06,50.69 111.44,53.07 111.92,53.07 111.92,54.18 IC2.11
  Bottom 0.229: v50.8,49.26 22.86,77.2 22.86,78.79 BAR1.6
DIG13
  Top 0.229: IC3.11 66.52,27.83 66.2,27.51 65.56,27.51 62.07,24.02 57.94,24.02 50.17,16.24 15.4,16.24 12.38,13.23 11.11,13.23 SEV8.1
  Bottom 0.229: SEV8.6 16.03,3.07 12.38,6.72 9.84,6.72 9.84,11.96 10.95,13.07 SEV8.1
DIG21  (via drill 0.3)
  Top 0.229: v59.21,75.61 63.02,71.81 112.49,71.81 113.35,70.95 113.35,69.27 IC1.6
  Bottom 0.229: v59.21,75.61 55.88,78.95 BAR2.7
DIG22  (via drill 0.3)
  Top 0.229: v94.62,58.95 85.41,58.95 v82.71,61.64
  Bottom 0.229: v94.62,58.95 99.22,54.34 IC2.6 | v82.71,61.64 81.92,62.44 81.92,64.98 72.55,74.34 56.07,74.34 54.01,76.41 33.21,76.41 28.16,81.46 25.88,81.46 25.21,80.79 25.21,78.98 BAR1.7
DIG23
  Bottom 0.229: 25.08,4.18 24.13,4.18 24.13,3.54 23.81,3.23 23.81,3.07 SEV9.6 | 25.08,4.18 26.83,4.18 28.1,2.91 28.1,1.32 44.61,1.32 47.31,4.02 60.01,4.02 62.87,6.88 62.87,11.48 66.52,15.13 IC3.6 | 25.08,4.18 25.08,9.26 22.54,9.26 18.73,13.07 SEV9.1
DIG31  (via drill 0.3)
  Top 0.229: v74.14,75.61 77.47,72.28 114.81,72.28 115.89,71.2 115.89,69.27 IC1.7
  Bottom 0.229: v74.14,75.61 71.12,78.63 71.12,78.79 BAR3.1
DIG32
  Top 0.229: IC2.7 101.76,54.34 101.76,55.87 101.06,56.56 85.73,56.56 81.44,52.28 33.81,52.28 30.8,55.3 28.73,55.3 25.56,52.12 23.5,52.12 21.59,54.02 SEV1.6
  Bottom 0.229: SEV1.1 16.67,64.19 18.73,62.12 18.73,56.88 21.59,54.02 SEV1.6
DIG33
  Top 0.229: IC3.7 66.52,17.83 65.09,19.26 55.4,19.26 50.8,14.66 34.32,14.66 34,14.97 28.1,14.97 26.35,13.23 SEV10.1
  Bottom 0.229: SEV10.6 31.27,3.07 28.26,6.08 28.26,11.32 26.35,13.23 SEV10.1
DIG41  (via drill 0.3)
  Top 0.229: v101.6,74.5 87.79,74.5 83.5,78.79 BAR3.6
  Bottom 0.229: v101.6,74.5 101.6,74.03 105.25,70.38 105.25,69.58 105.57,69.27 IC1.3
DIG42
  Top 0.229: IC2.3 91.6,54.18 91.6,53.07 91.12,53.07 90.01,51.96 89.69,51.96 89.54,51.8 32.7,51.8 30.32,54.18 29.37,54.18 SEV2.6
  Bottom 0.229: SEV2.1 24.29,64.19 27.31,61.17 27.31,55.77 28.89,54.18 29.21,54.18 SEV2.6
DIG43
  Bottom 0.229: 72.23,53.87 72.23,54.02 SEV5.6 72.23,53.87 | 72.23,53.87 72.23,53.39 70.17,51.33 70.17,7.67 66.68,7.67 IC3.3 | 72.23,53.87 70.33,55.77 70.33,61.17 67.31,64.19 SEV5.1
DIG51  (via drill 0.3)
  Top 0.229: v85.88,74.19 87.31,72.76 122.21,72.76 123.51,71.46 123.51,69.27 IC1.10
  Bottom 0.229: v85.88,74.19 86.2,74.5 86.2,78.79 BAR3.7
DIG52  (via drill 0.3)
  Top 0.229: v54.45,51.01 54.77,51.33 89.69,51.33 89.85,51.48 107.32,51.48 108.9,53.07 109.38,53.07 109.38,54.18 IC2.10
  Bottom 0.229: v54.45,51.01 46.99,58.47 46.99,62.76 SEV3.6 46.83,62.91 46.83,63.71 44.93,65.61 44.93,69.9 41.91,72.92 SEV3.1
DIG53  (via drill 0.3)
  Top 0.229: v74.77,31.32 72.55,31.32 66.68,25.45 IC3.10 | v77.79,55.93 79.53,54.18 79.85,54.18 SEV6.6
  Bottom 0.229: v74.77,31.32 77.47,34.02 77.47,38.09 79.06,39.67 79.06,52.6 79.85,53.39 79.85,54.02 SEV6.6 | v77.79,55.93 77.79,61.33 74.93,64.19 SEV6.1
DIG62  (via drill 0.3)
  Top 0.229: v93.66,50.69 93.5,50.85 60.96,50.85 v60.64,50.53 | v56.99,61.64 55.88,62.76 54.61,62.76 SEV4.6
  Bottom 0.229: v93.66,50.69 95.73,52.76 95.73,53.23 96.68,54.18 IC2.5 | v60.64,50.53 56.99,54.18 v56.99,61.64 | SEV4.1 49.53,72.92 52.04,70.4 52.04,65.16 54.45,62.76 SEV4.6
DIN
  Top 0.229: IC1.1 100.65,69.11 104.14,65.61 119.86,65.61 122.4,63.07 CONV.5
DIN3
  Top 0.229: FEATHERM0.22 102.87,46.72 106.36,50.22 119.86,50.22 122.4,52.76 CONV.11
GND  (25 unrouted)
  Top 0.229: C5.2 73.53,14.25 74.52,13.26 74.52,9.19 73.5,8.18 70.71,8.18 68.68,10.2 IC3.4 | C6.2 75.09,27.5 77.54,29.95 79.34,29.95 C4.2
  pour Bottom (isolate 0.305): 0,89 0,0 76.05,0 76.05,21.98 99.55,21.98 99.55,0 110.1,0 arc90 135.1,25 135.1,89
LOAD  (via drill 0.3)
  Top 0.229: v85.73,43.39 81.12,38.78 74.93,38.78 66.68,30.53 IC3.12 | CONV.2 129.86,62.91 121.76,54.82 116.21,54.82 115.73,54.34 114.62,54.34 IC2.12
  Bottom 0.229: IC1.12 128.59,69.11 130.02,67.68 130.02,63.07 CONV.2 | v85.73,43.39 88.9,46.56 88.9,47.2 91.12,49.42 114.14,49.42 114.14,52.91 114.46,53.23 114.46,54.18 IC2.12
LOAD3
  Top 0.229: FEATHERM0.23 105.41,46.72 107.32,48.63 125.89,48.63 130.02,52.76 CONV.8
N$1  (via drill 0.3)
  Top 0.229: v120.17,81.17 122.87,83.87 124.62,83.87 R1.P$2
  Bottom 0.229: v120.17,81.17 115.89,76.88 IC1.18
N$2
  Top 0.229: 6.19,44.98 5.72,45.45 MOSFET.GND | 15.88,35.29 15.56,35.29 SOUT.P$1 | 21.27,37.2 D1.ANOD
  Top 0.508: 6.19,44.98 6.99,44.98 14.84,37.12 | 14.84,37.12 15.88,36.09 15.88,35.29 | 21.27,37.2 14.92,37.2 14.84,37.12
N$3  (via drill 0.3)
  Top 0.229: v79.85,50.06 79.53,49.74 60.48,49.74 60.17,50.06 7.62,50.06 5.72,48.15 MOSFET.IN | v83.98,55.77 86.36,58.15 114.3,58.15 119.06,62.91 119.7,62.91 CONV.6
  Bottom 0.229: v79.85,50.06 83.98,54.18 v83.98,55.77
N$8  (via drill 0.3)
  Top 0.229: v61.6,13.23 63.5,11.32 70.49,11.32 71.28,10.53 72.07,10.53 R3.P$2
  Bottom 0.229: v61.6,13.23 61.6,15.13 59.06,17.67 IC3.18
N$9
  Bottom 0.229: IC2.18 101.76,61.96 96.52,67.2 96.04,67.2 R2.P$2
N$13
  Bottom 0.229: IC2.1 86.52,54.34 84.77,56.09 84.77,69.11 92.39,76.73 100.49,76.73 IC1.24
N$14
  Bottom 0.229: IC3.1 66.68,2.59 68.26,2.59 70.17,4.49 74.61,8.94 74.61,22.75 83.98,32.12 83.98,49.42 87.63,53.07 87.63,59.58 86.52,60.69 86.52,61.8 IC2.24
RESET  (via drill 0.3)  (1 unrouted)
  Top 0.229: v122.71,20.85 128.11,26.24 FEATHERM0.1
  Bottom 0.229: v122.71,20.85 122.71,17.04 J1.2
S1  (2 unrouted)
  Top 0.229: SW1.1 53.18,38.15 51.28,36.24 51.28,32.44 52.39,31.32 53.88,31.32 63.09,40.53 80.96,40.53 84.61,44.18 95.57,44.18 97.63,46.25 97.63,46.56 FEATHERM0.20
S2  (2 unrouted)
  Top 0.229: SW1.2 53.34,35.77 65.88,48.31 89.38,48.31 89.69,48.63 93.35,48.63 95.25,46.72 FEATHERM0.19
S3  (2 unrouted)
  Top 0.229: SW1.3 53.34,33.23 61.12,41.01 80.81,41.01 84.46,44.66 90.96,44.66 92.55,46.25 92.55,46.56 FEATHERM0.18
SEGA1  (via drill 0.3)
  Top 0.229: IC1.14 125.89,76.73 125.89,75.3 123.83,73.23 87.79,73.23 84.61,76.41 v75.88,76.41 45.56,76.41 43.18,78.79 BAR2.2
  Bottom 0.229: v75.88,76.41 73.66,78.63 73.66,78.79 BAR3.2
SEGA2
  Top 0.229: 21.43,66.25 21.43,64.34 21.59,64.34 SEV1.10 | 21.43,66.25 21.43,70.06 12.7,78.79 BAR1.2 | 21.43,66.25 27.31,66.25 29.21,64.34 SEV2.10 29.21,64.5 39.69,74.98 46.99,74.98 | IC2.14 111.92,61.96 111.92,64.25 111.03,65.14 94.46,65.14 89.54,70.06 57.79,70.06 54.93,72.92 54.61,72.92 SEV4.10 54.45,73.08 53.82,73.08 51.91,74.98 46.99,74.98 | 46.99,74.98 46.99,73.08 SEV3.10
SEGA3  (via drill 0.3)
  Top 0.229: SEV7.10 8.57,13.07 9.37,12.27 10.08,12.27 10.56,11.8 11.59,11.8 13.02,13.23 16.03,13.23 SEV8.10 16.19,13.07 16.83,13.07 18.1,11.8 22.38,11.8 23.65,13.07 SEV9.10 23.81,13.07 24.61,12.27 25.32,12.27 25.8,11.8 28.1,11.8 29.21,12.91 30.48,12.91 30.64,13.07 31.27,13.07 SEV10.10 | SEV5.10 72.39,64.19 73.18,63.39 73.82,63.39 74.3,62.91 77.95,62.91 79.22,64.19 79.85,64.19 SEV6.10 | v41.12,23.23 53.66,23.23 57.94,27.51 58.58,27.51 58.9,27.83 IC3.14
  Bottom 0.229: v41.12,23.23 31.43,13.54 31.43,13.23 SEV10.10 | SEV5.10 72.23,64.34 70.49,66.09 66.64,66.09 63.15,62.6 63.15,31.45 59.69,27.99 59.06,27.99 IC3.14
SEGB1  (via drill 0.3)
  Top 0.229: v80.01,84.03 78.42,82.44 77.15,82.44 75.01,84.58 | 75.01,84.58 73.66,85.93 73.66,86.41 BAR3.13 | BAR2.13 43.18,86.41 45.09,84.5 74.93,84.5 75.01,84.58
  Bottom 0.229: v80.01,84.03 87.81,84.03 89.87,86.09 117.32,86.09 120.97,82.44 120.97,76.88 IC1.16
SEGB2  (via drill 0.3)
  Top 0.229: BAR1.13 12.54,86.41 8.1,81.97 8.1,70.76 14.61,64.25 14.61,61.23 15.46,60.38 17.15,60.38 18.26,61.49 21.43,61.49 21.59,61.64 SEV1.9 21.75,61.64 22.38,61.64 23.65,60.38 26.92,60.38 28.1,61.55 SEV2.9 | v96.36,70.53 96.04,70.85 v58.71,70.85 | SEV4.9 54.45,70.53 53.66,70.53 49.85,74.34 48.58,74.34 48.1,73.87 48.1,71.65 46.99,70.53 SEV3.9 46.99,70.69 45.88,70.69 42.23,74.34 40.32,74.34 v32.54,66.57
  Bottom 0.229: v96.36,70.53 100.01,66.88 101.92,66.88 106.84,61.96 IC2.16 | v58.71,70.85 54.61,70.85 54.61,70.53 SEV4.9 | v32.54,66.57 32.54,64.98 29.37,61.8 SEV2.9
SEGB3  (via drill 0.3)
  Top 0.229: SEV7.9 8.57,10.53 9.37,9.73 10.16,9.73 10.64,9.26 11.59,9.26 13.02,10.69 16.03,10.69 SEV8.9 16.19,10.53 16.83,10.53 18.1,9.26 22.38,9.26 23.65,10.53 SEV9.9 23.81,10.53 24.61,9.73 25.32,9.73 25.8,9.26 28.1,9.26 29.21,10.37 30.48,10.37 30.64,10.53 31.27,10.53 SEV10.9 | SEV6.9 79.85,61.64 79.22,61.64 77.95,60.38 74.3,60.38 73.82,60.85 73.18,60.85 72.39,61.64 SEV5.9 72.23,61.64 70.96,60.38 66.68,60.38 v61.44,55.14 | v36.51,15.45 50.96,15.45 57.94,22.43 58.58,22.43 58.9,22.75 IC3.16
  Bottom 0.229: v36.51,15.45 31.75,10.69 31.43,10.69 SEV10.9 | v61.44,55.14 61.44,36.09 56.52,31.16 56.52,24.66 58.26,22.91 58.9,22.91 IC3.16
SEGC1
  Top 0.229: IC1.20 110.65,76.73 110.65,74.53 109.82,73.71 87.95,73.71 84.77,76.88 77.95,76.88 76.04,78.79 BAR3.3 76.04,78.63 75.88,78.63 74.14,76.88 47.63,76.88 45.72,78.79 BAR2.3
SEGC2  (via drill 0.3)
  Top 0.229: SEV1.8 21.75,59.11 22.38,59.11 23.65,57.84 25.91,57.84 26.23,58.15 27.24,58.15 28.1,59.01 SEV2.8 29.37,59.11 29.69,58.79 44.77,58.79 45.56,59.58 v47.78,59.58 | v93.35,65.3 82.55,65.3 80.17,67.68 55.4,67.68 55.25,67.84 54.61,67.84 SEV4.8
  Bottom 0.229: BAR1.3 15.24,78.79 19.21,74.82 19.21,60.47 20.63,59.05 SEV1.8 | v93.35,65.3 96.68,61.96 IC2.20 | 48.02,69.03 48.1,69.11 48.1,73.55 49.53,74.98 50.64,74.98 52.55,73.08 52.55,69.74 54.45,67.84 SEV4.8 | 48.02,69.03 46.99,68 SEV3.8 | v47.78,59.58 48.1,59.9 48.1,68.95 48.02,69.03
SEGC3  (via drill 0.3)
  Top 0.229: SEV7.8 8.57,7.99 9.37,7.19 10.16,7.19 10.64,6.72 11.59,6.72 13.02,8.15 16.03,8.15 SEV8.8 | SEV5.8 72.39,59.11 73.18,58.31 73.82,58.31 74.3,57.84 77.95,57.84 79.22,59.11 79.85,59.11 SEV6.8 | v70.96,28.62 69.06,26.72 69.06,16.72 64.93,16.72 62.23,14.02 61.44,14.02 59.69,12.27 58.74,12.27 IC3.20 58.9,12.59 58.58,12.27 57.94,12.27 54.77,9.1 33.66,9.1 32.7,8.15 31.43,8.15 SEV10.8 31.27,7.99 30.64,7.99 30.48,7.83 29.72,7.83 28.61,6.72 25.88,6.72 25.4,7.19 24.61,7.19 23.81,7.99 SEV9.8
  Bottom 0.229: SEV9.8 23.65,7.99 22.38,6.72 16.51,6.72 16.51,7.67 16.19,7.99 SEV8.8 | v70.96,28.62 70.96,50.85 73.66,53.55 73.66,57.84 72.39,59.11 SEV5.8
SEGD1
  Bottom 0.229: 76.99,83.71 77.47,83.23 97.47,83.23 102.71,78 102.71,77.2 103.03,76.88 IC1.23 | 76.99,83.71 76.99,85.14 76.2,85.93 76.2,86.41 BAR3.12 | 76.99,83.71 48.42,83.71 45.72,86.41 BAR2.12
SEGD2  (via drill 0.3)
  Top 0.229: SEV2.5 24.13,54.18 23.02,55.3 18.1,55.3 16.99,54.18 16.67,54.18 SEV1.5 | v83.82,64.03 83.98,64.19 86.84,64.19 89.06,61.96 IC2.23 | v61.6,64.34 57.63,60.38 v50.64,60.38 | SEV4.5 49.53,62.76 47.63,60.85 43.82,60.85 41.91,62.76 SEV3.5 41.75,62.76 41.12,62.76 v37.94,59.58
  Bottom 0.229: BAR1.12 15.08,86.41 8.1,79.42 8.1,62.44 16.51,54.02 SEV1.5 | v83.82,64.03 83.5,63.71 83.5,61.01 82.87,60.38 78.27,60.38 78.27,61.49 76.84,62.91 76.84,64.98 75.25,66.57 63.82,66.57 v61.6,64.34 | v50.64,60.38 49.53,61.49 49.53,62.76 SEV4.5 | v37.94,59.58 37.94,54.15 35.91,52.12 26.19,52.12 24.29,54.02 SEV2.5
SEGD3
  Top 0.229: SEV5.5 67.31,54.18 68.1,54.98 71.44,54.98 71.76,55.3 73.66,55.3 74.77,54.18 SEV6.5 | SEV7.5 3.49,3.07 4.29,3.86 5.75,3.86 6.06,4.18 9.21,4.18 10.32,3.07 10.95,3.07 SEV8.5 | IC3.23 58.94,5.16 56.67,5.16 53.31,1.8 32.39,1.8 31.91,1.32 30.61,1.32 29.02,2.91 26.35,2.91 SEV10.5 26.19,3.07 25.56,3.07 24.45,4.18 23.18,4.18 22.86,3.86 19.53,3.86 18.73,3.07 SEV9.5
  Bottom 0.229: SEV8.5 11.11,2.91 12.7,1.32 17.3,1.32 18.57,2.59 18.57,2.91 SEV9.5 | SEV5.5 67.15,54.02 64.77,51.64 64.77,29.26 62.39,26.88 62.39,7.83 59.69,5.13 59.06,5.13 IC3.23
SEGDP1  (via drill 0.3)  (1 unrouted)
  Top 0.229: v101.12,82.12 85.41,82.12 81.12,86.41 BAR3.10 81.12,86.25 80.96,86.25 79.38,84.66 76.36,84.66 v76.2,84.5
  Bottom 0.229: 105.57,76.88 105.25,77.2 105.25,78 v101.12,82.12 | v76.2,84.5 52.71,84.5 50.8,86.41 BAR2.10
SEGDP2  (via drill 0.3)  (1 unrouted)
  Top 0.229: 91.6,61.8 91.6,60.69 91.12,60.69 89.85,59.42 85.88,59.42 v82.71,62.6
  Bottom 0.229: v82.71,62.6 82.39,62.91 82.39,65.14 72.71,74.82 58.07,74.82 56.01,76.88 37.69,76.88 30.07,84.5 21.05,84.5 20.64,84.92 20.64,86.09 20.32,86.41 BAR1.10
SEGDP3  (via drill 0.3)  (1 unrouted)
  Top 0.229: 58.9,7.67 58.58,7.99 56.83,7.99 56.67,8.15 36.83,8.15 32.86,4.18 25.08,4.18 23.81,5.45 SEV9.7 23.81,5.29 20.32,5.29 19.21,4.18 9.84,4.18 8.57,5.45 SEV7.7 | v70.8,6.56 65.56,6.56 64.45,7.67 59.06,7.67
  Bottom 0.229: v70.8,6.56 73.98,9.73 74.01,27.99 72.71,29.71 72.71,37.52 77.95,42.75 77.95,54.66 79.85,56.56 SEV6.7
SEGE1  (via drill 0.3)
  Top 0.229: v104.62,81.17 80.81,81.17 78.58,78.95 BAR3.4 78.58,79.11 78.42,79.11 76.68,80.85 50.17,80.85 48.26,78.95 BAR2.4
  Bottom 0.229: v104.62,81.17 107.79,78 107.79,77.2 108.11,76.88 IC1.21
SEGE2  (via drill 0.3)
  Top 0.229: SEV1.4 16.67,56.72 17.46,57.52 20.44,57.52 20.76,57.84 22.66,57.84 23.92,56.57 SEV2.4 26.07,56.57 27.01,57.52 28.42,57.52 28.73,57.84 44.77,57.84 v45.24,58.31 56.52,58.31 63.98,65.77 80.81,65.77 83.34,63.23 83.98,63.23 84.14,63.39 v85.57,63.39 | SEV4.4 49.37,65.3 49.37,64.66 48.1,63.39 48.1,61.96 47.63,61.49 45.88,61.49 42.07,65.3 41.91,65.3 SEV3.4
  Bottom 0.229: BAR1.4 17.78,78.79 19.69,76.88 19.69,61.3 20.61,60.38 22.48,60.38 23.02,59.84 23.02,57.84 24.13,56.72 SEV2.4 | v85.57,63.39 85.57,64.34 91.76,64.34 94.14,61.96 IC2.21 | v45.24,58.31 43.82,59.74 43.82,63.55 41.91,65.45 SEV3.4
SEGE3  (via drill 0.3)
  Top 0.229: SEV7.4 3.49,5.61 4.29,6.4 6.51,6.4 6.83,6.72 9.84,6.72 10.95,5.61 SEV8.4 11.11,5.61 11.43,5.61 12.54,6.72 17.46,6.72 18.57,5.61 SEV9.4 18.73,5.61 19.53,6.4 22.86,6.4 23.18,6.72 25.08,6.72 26.19,5.61 SEV10.4 26.35,5.61 29.15,5.61 30.26,6.72 32.86,6.72 34.77,8.62 56.83,8.62 57.94,9.73 58.58,9.73 58.9,10.05 IC3.21 | SEV6.4 74.77,56.72 73.66,57.84 71.76,57.84 71.44,57.52 68.1,57.52 67.31,56.72 SEV5.4 67.15,56.56 63.66,53.07 v57.15,53.07
  Bottom 0.229: v57.15,53.07 57.15,50.53 55.25,48.63 55.25,18.15 55.09,17.99 55.09,13.39 58.26,10.21 58.9,10.21 IC3.21
SEGF1
  Top 0.229: BAR2.11 48.26,86.57 49.85,88.16 56.67,88.16 57.15,87.68 69.53,87.68 70.01,88.16 76.99,88.16 78.58,86.57 BAR3.11
  Bottom 0.229: IC1.15 123.35,76.88 123.03,77.2 123.03,78 121.44,79.58 121.44,82.6 117.48,86.57 89.12,86.57 87.05,84.5 80.49,84.5 78.74,86.25 78.74,86.41 BAR3.11
SEGF2  (via drill 0.3)
  Top 0.229: SEV1.2 16.67,61.8 16.99,61.8 18.1,62.91 23.02,62.91 24.13,61.8 SEV2.2 24.29,61.8 26.1,61.8 27.21,62.91 34.29,62.91 41.75,70.38 SEV3.2 | 51.99,62.68 51.44,63.23 51.44,69.36 50.74,70.06 49.85,70.06 49.53,70.38 SEV4.2 | 51.99,62.68 53.82,60.85 57.15,60.85 62.55,66.25 80.96,66.25 82.39,64.82 87.47,64.82 87.79,64.5 108.62,64.5 109.38,63.74 109.38,61.96 IC2.15 | v41.59,60.38 49.69,60.38 51.99,62.68
  Bottom 0.229: BAR1.11 17.62,86.41 13.97,82.76 13.97,78.31 14.61,77.68 14.61,63.55 16.51,61.64 SEV1.2 | v41.59,60.38 39.85,62.12 39.85,68.47 41.75,70.38 SEV3.2
SEGF3  (via drill 0.3)
  Top 0.229: SEV7.2 3.49,10.69 4.29,11.48 6.76,11.48 7.08,11.8 9.84,11.8 10.95,10.69 SEV8.2 11.11,10.69 11.43,10.69 12.54,11.8 17.46,11.8 18.57,10.69 SEV9.2 18.73,10.53 21.91,10.53 23.18,11.8 25.08,11.8 26.19,10.69 SEV10.2 | SEV6.2 74.77,61.8 73.66,62.91 68.74,62.91 67.63,61.8 67.31,61.8 SEV5.2 | v33.81,22.43 55.4,22.43 58.26,25.29 58.9,25.29 IC3.15
  Bottom 0.229: IC3.15 59.06,25.45 63.82,30.21 63.82,58.47 67.15,61.8 SEV5.2 | v33.81,22.43 25.08,13.7 25.08,11.8 26.19,10.69 SEV10.2
SEGG1
  Top 0.229: IC1.17 118.43,76.88 118.43,79.58 117.63,80.38 87.47,80.38 87.16,80.69 82.87,80.69 81.12,78.95 BAR3.5
  Bottom 0.229: BAR2.5 50.8,78.95 52.71,80.85 57.31,80.85 57.31,79.9 57.94,79.27 68.74,79.27 70.33,80.85 80.81,80.85 80.81,79.74 81.12,79.42 81.12,78.95 BAR3.5
SEGG2  (via drill 0.3)
  Top 0.229: SEV1.3 16.67,59.26 17.46,60.06 20.8,60.06 21.11,60.38 23.02,60.38 24.13,59.26 SEV2.3 24.29,59.26 27.11,59.26 28.23,60.38 34.29,60.38 41.75,67.84 SEV3.3 | v85.57,68.79 85.25,68.47 v62.87,68.47 | v48.9,57.52 v46.99,57.52
  Bottom 0.229: BAR1.5 20.32,78.79 23.02,76.09 23.02,60.69 24.13,59.58 24.13,59.26 SEV2.3 | v85.57,68.79 85.57,69.27 97,69.27 104.3,61.96 IC2.17 | v62.87,68.47 55.25,60.85 51.44,60.85 | 51.44,60.85 51.44,66.09 49.53,68 SEV4.3 | v46.99,57.52 44.93,59.58 44.93,64.82 41.91,67.84 SEV3.3 | v48.9,57.52 51.44,60.06 51.44,60.85
SEGG3  (via drill 0.3)
  Top 0.229: SEV7.3 3.49,8.15 4.29,8.94 6.51,8.94 6.83,9.26 9.84,9.26 10.95,8.15 SEV8.3 11.11,8.15 11.43,8.15 12.54,9.26 17.46,9.26 18.57,8.15 SEV9.3 18.73,7.99 21.91,7.99 23.18,9.26 25.08,9.26 26.19,8.15 SEV10.3 28.25,8.01 29.18,8.94 30.48,8.94 30.8,9.26 31.91,9.26 36.83,14.18 54.52,14.18 v56.9,16.56 | SEV6.3 74.77,59.26 73.66,60.38 71.76,60.38 70.64,59.26 67.31,59.26 SEV5.3
  Bottom 0.229: SEV5.3 67.15,59.26 64.29,56.41 64.29,29.42 61.91,27.04 61.91,23.23 59.06,20.37 IC3.17 57.57,20.36 56.94,19.73 56.94,18.33 56.94,16.61 v56.9,16.56
SOL  (1 unrouted)
STA  (via drill 0.3)  (2 unrouted)
  Top 0.229: v101.85,31.29 104.39,31.29 106.66,29.03 106.66,25.57 110.27,21.96 116.84,21.96 119.86,18.94 123.51,18.94 125.1,17.35 125.1,17.04 J1.3
  Bottom 0.229: v101.85,31.29 101.85,34.88 90.17,46.56 FEATHERM0.17

### Text on the board
tPlace: SOLENOID | KETTLE META-CONTROLLER / rev1. Jan-2019 / Design Informatics | 12V IN | BTN